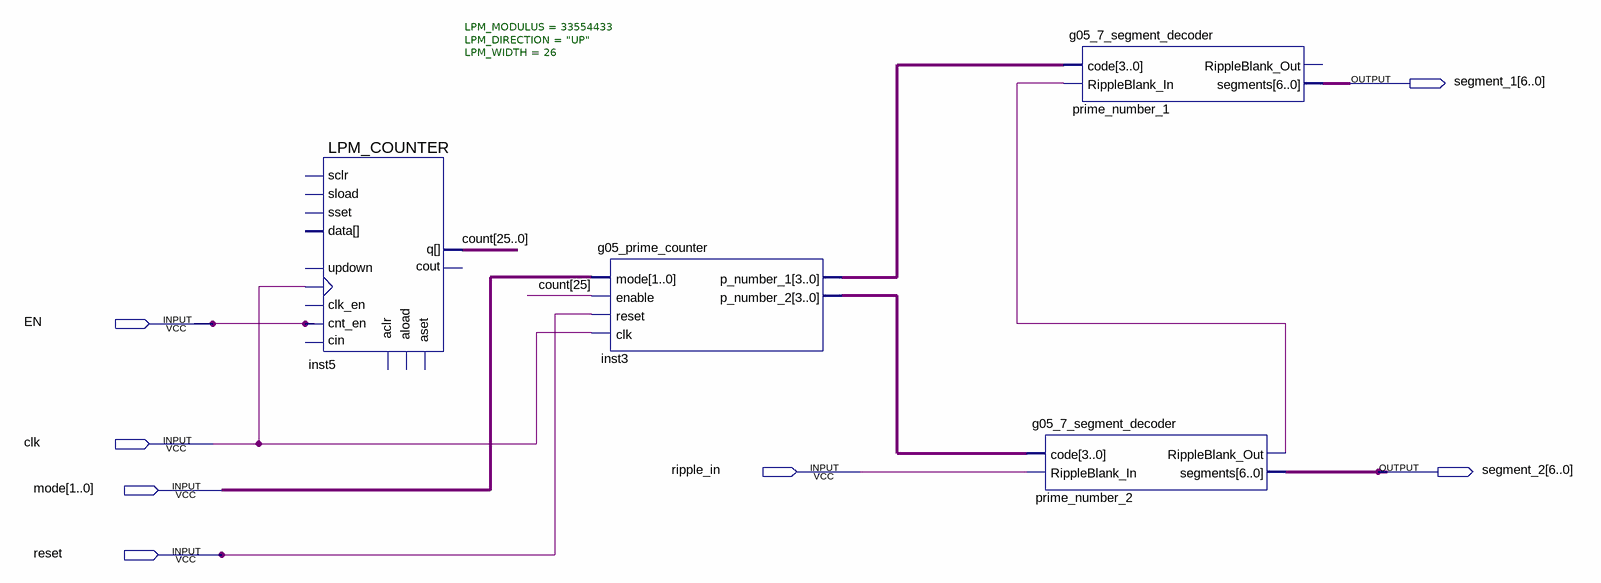
[diagram p0: schematic sheet]
// Quartus schematic g05_lab4.bdf as structural Verilog: 4 symbols, 7 pins
module g05_lab4 (
  input  EN,
  input  clk,
  input  ripple_in,
  input  [1:0] mode,
  input  reset,
  output [6:0] segment_1,
  output [6:0] segment_2
);

  wire prime_number_2_rippleblank_out;
  wire [3:0] inst3_p_number_1, inst3_p_number_2;
  wire [25:0] count;

  LPM_COUNTER #(.LPM_MODULUS(33554433), .LPM_DIRECTION("UP"), .LPM_WIDTH(26)) inst5 (
    .clock(clk), .cnt_en(EN), .q(count));  // open: sload, data, clk_en, aload, aclr, aset, cin, sset, updown, sclr, cout
  g05_prime_counter inst3 (
    .mode(mode), .enable(count[25]), .reset(reset), .clk(clk), .p_number_1(inst3_p_number_1),
    .p_number_2(inst3_p_number_2));
  g05_7_segment_decoder prime_number_1 (
    .code(inst3_p_number_1), .RippleBlank_In(prime_number_2_rippleblank_out), .segments(segment_1));  // open: RippleBlank_Out
  g05_7_segment_decoder prime_number_2 (
    .code(inst3_p_number_2), .RippleBlank_In(ripple_in), .RippleBlank_Out(prime_number_2_rippleblank_out),
    .segments(segment_2));
endmodule
